# Altium schematic sheet Placa_do_uControlador.SchDoc: Conections MSP432P401r - Texas
size A4; Author: Eng. Davi Alexandre; CompanyName: Lamotriz; Organization: UFC; Address1: Fortaleza, Ceará - Brasil; Address2: Frenchs Forest; Address3: NSW; Address4: Australia 2086; Revision: Prof. Dr. Wilclkey Bezerra; SheetNumber: 1; SheetTotal: 2; Machine: Lightweight Robot Arm; VersionProject: 2
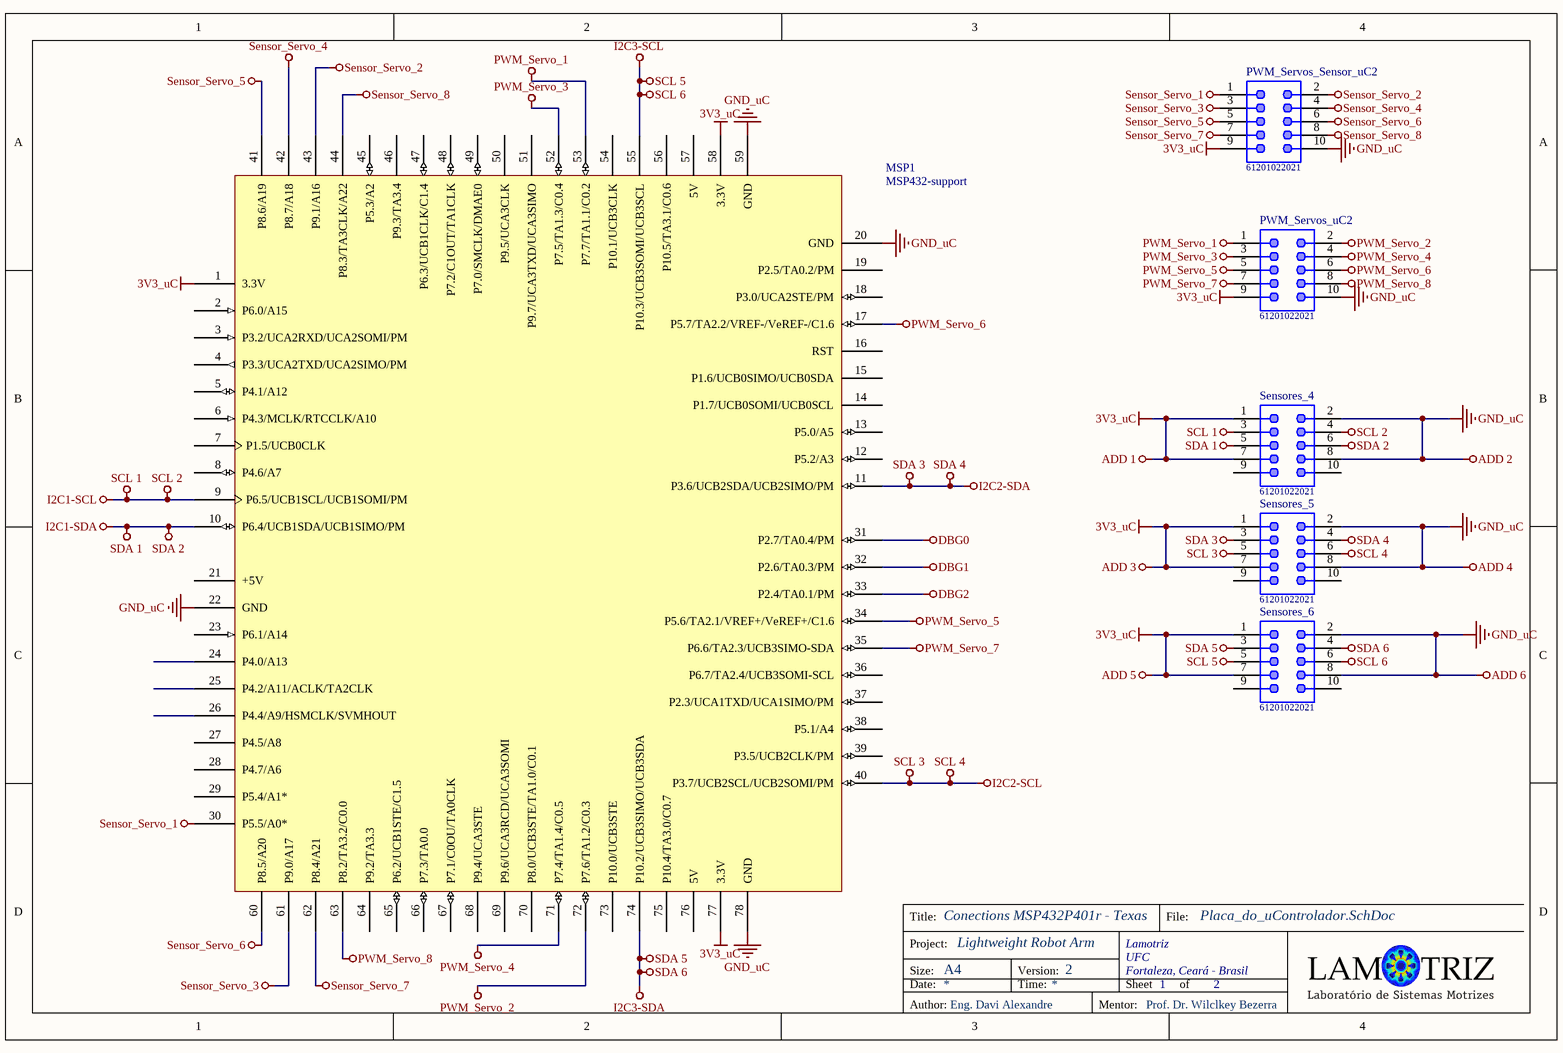
[diagram p0: Placa_do_uControlador.SchDoc]

## Parts
MSP1  MSP432-support  [Msp432_Suport]
PWM_Servos_Sensor_uC2  61201022021  [61201022021]
PWM_Servos_uC2  61201022021  [61201022021]
Sensores_4  61201022021  [61201022021]
Sensores_5  61201022021  [61201022021]
Sensores_6  61201022021  [61201022021]

## Nets
3V3_uC: MSP1.1(3.3V) MSP1.58(3.3V) MSP1.77(3.3V) PWM_Servos_Sensor_uC2.9 PWM_Servos_uC2.9 Sensores_4.1 Sensores_4.7 Sensores_5.1 Sensores_5.7 Sensores_6.1 Sensores_6.7  [also labelled ADD 1, ADD 3, ADD 5]
ADD 2: MSP1.20(GND) MSP1.22(GND) MSP1.59(GND) MSP1.78(GND) PWM_Servos_Sensor_uC2.10 PWM_Servos_uC2.10 Sensores_4.2 Sensores_4.8 Sensores_5.2 Sensores_5.8 Sensores_6.2 Sensores_6.8  [also labelled ADD 4, ADD 6, GND_uC]
DBG0: MSP1.31(P2.7/TA0.4/PM)
DBG1: MSP1.32(P2.6/TA0.3/PM)
DBG2: MSP1.33(P2.4/TA0.1/PM)
I2C1-SCL: MSP1.9(P6.5/UCB1SCL/UCB1SOMI/PM) Sensores_4.3 Sensores_4.4  [also labelled SCL 1, SCL 2]
I2C1-SDA: MSP1.10(P6.4/UCB1SDA/UCB1SIMO/PM) Sensores_4.5 Sensores_4.6  [also labelled SDA 1, SDA 2]
I2C2-SCL: MSP1.40(P3.7/UCB2SCL/UCB2SOMI/PM) Sensores_5.5 Sensores_5.6  [also labelled SCL 3, SCL 4]
I2C2-SDA: MSP1.11(P3.6/UCB2SDA/UCB2SIMO/PM) Sensores_5.3 Sensores_5.4  [also labelled SDA 3, SDA 4]
I2C3-SCL: MSP1.55(P10.3/UCB3SOMI/UCB3SCL) Sensores_6.5 Sensores_6.6  [also labelled SCL 5, SCL 6]
I2C3-SDA: MSP1.74(P10.2/UCB3SIMO/UCB3SDA) Sensores_6.3 Sensores_6.4  [also labelled SDA 5, SDA 6]
PWM_Servo_1: MSP1.53(P7.7/TA1.1/C0.2) PWM_Servos_uC2.1
PWM_Servo_2: MSP1.72(P7.6/TA1.2/C0.3) PWM_Servos_uC2.2
PWM_Servo_3: MSP1.52(P7.5/TA1.3/C0.4) PWM_Servos_uC2.3
PWM_Servo_4: MSP1.71(P7.4/TA1.4/C0.5) PWM_Servos_uC2.4
PWM_Servo_5: MSP1.34(P5.6/TA2.1/VREF+/VeREF+/C1.6) PWM_Servos_uC2.5
PWM_Servo_6: MSP1.17(P5.7/TA2.2/VREF-/VeREF-/C1.6) PWM_Servos_uC2.6
PWM_Servo_7: MSP1.35(P6.6/TA2.3/UCB3SIMO-SDA) PWM_Servos_uC2.7
PWM_Servo_8: MSP1.63(P8.2/TA3.2/C0.0) PWM_Servos_uC2.8
Sensor_Servo_1: MSP1.30(P5.5/A0*) PWM_Servos_Sensor_uC2.1
Sensor_Servo_2: MSP1.43(P9.1/A16) PWM_Servos_Sensor_uC2.2
Sensor_Servo_3: MSP1.61(P9.0/A17) PWM_Servos_Sensor_uC2.3
Sensor_Servo_4: MSP1.42(P8.7/A18) PWM_Servos_Sensor_uC2.4
Sensor_Servo_5: MSP1.41(P8.6/A19) PWM_Servos_Sensor_uC2.5
Sensor_Servo_6: MSP1.60(P8.5/A20) PWM_Servos_Sensor_uC2.6
Sensor_Servo_7: MSP1.62(P8.4/A21) PWM_Servos_Sensor_uC2.7
Sensor_Servo_8: MSP1.44(P8.3/TA3CLK/A22) PWM_Servos_Sensor_uC2.8

Not connected (* = marked no-connect by the designer): MSP1 2(P6.0/A15) 3(P3.2/UCA2RXD/UCA2SOMI/PM) 4(P3.3/UCA2TXD/UCA2SIMO/PM) 5(P4.1/A12) 6(P4.3/MCLK/RTCCLK/A10) 7(P1.5/UCB0CLK) 8(P4.6/A7) 12(P5.2/A3) 13(P5.0/A5) 14(P1.7/UCB0SOMI/UCB0SCL) 15(P1.6/UCB0SIMO/UCB0SDA) 16(RST) 18(P3.0/UCA2STE/PM) 19(P2.5/TA0.2/PM) 21(+5V) 23(P6.1/A14) 24(P4.0/A13) 25(P4.2/A11/ACLK/TA2CLK) 26(P4.4/A9/HSMCLK/SVMHOUT) 27(P4.5/A8) 28(P4.7/A6) 29(P5.4/A1*) 36(P6.7/TA2.4/UCB3SOMI-SCL) 37(P2.3/UCA1TXD/UCA1SIMO/PM) 38(P5.1/A4) 39(P3.5/UCB2CLK/PM) 45(P5.3/A2) 46(P9.3/TA3.4) 47(P6.3/UCB1CLK/C1.4) 48(P7.2/C1OUT/TA1CLK) 49(P7.0/SMCLK/DMAE0) 50(P9.5/UCA3CLK) 51(P9.7/UCA3TXD/UCA3SIMO) 54(P10.1/UCB3CLK) 56(P10.5/TA3.1/C0.6) 57(5V) 64(P9.2/TA3.3) 65(P6.2/UCB1STE/C1.5) 66(P7.3/TA0.0) 67(P7.1/C0OU/TA0CLK) 68(P9.4/UCA3STE) 69(P9.6/UCA3RCD/UCA3SOMI) 70(P8.0/UCB3STE/TA1.0/C0.1) 73(P10.0/UCB3STE) 75(P10.4/TA3.0/C0.7) 76(5V); Sensores_4 9 10; Sensores_5 9 10; Sensores_6 9 10

## Notes on the sheet
- Title:
- File:
- Project:
- Size:
- Date:
- A4
- Version:
- Time:
- Sheet
- of
- Author:
- Mentor:

## Library data of the parts
MSP1 = U*
PWM_Servos_Sensor_uC2 PWM_Servos_uC2 Sensores_4-Sensores_6 = 61201022021: Male Box Header WR-BHD with lever, THT, Vertical, pitch 2.54 mm, 10 pins; Pitch: 2.54 mm; Working Voltage: 250 VAC; Withstanding Voltage: 500 VAC; Contact Resistance: 20 mOhm; Pin Number: 10; ComponentLink1Description: Manufacturer; ComponentLink1URL: http://www.we-online.de; ComponentLink2Description: Datasheet; ComponentLink2URL: https://katalog.we-online.de/em/datasheet/6120xx22021.pdf; Part Number: 61201022021; Published Date: August 2018; Publisher: Wurth Elektronik; Operating Temperature: -40 to 125 degC; Packaging: Tray; Gender: Male; Mounting Technology: THT; Orientation: Vertical